# Altium schematic sheet Servo Level Shifter.SchDoc
size A; SheetNumber: 4; SheetTotal: 4
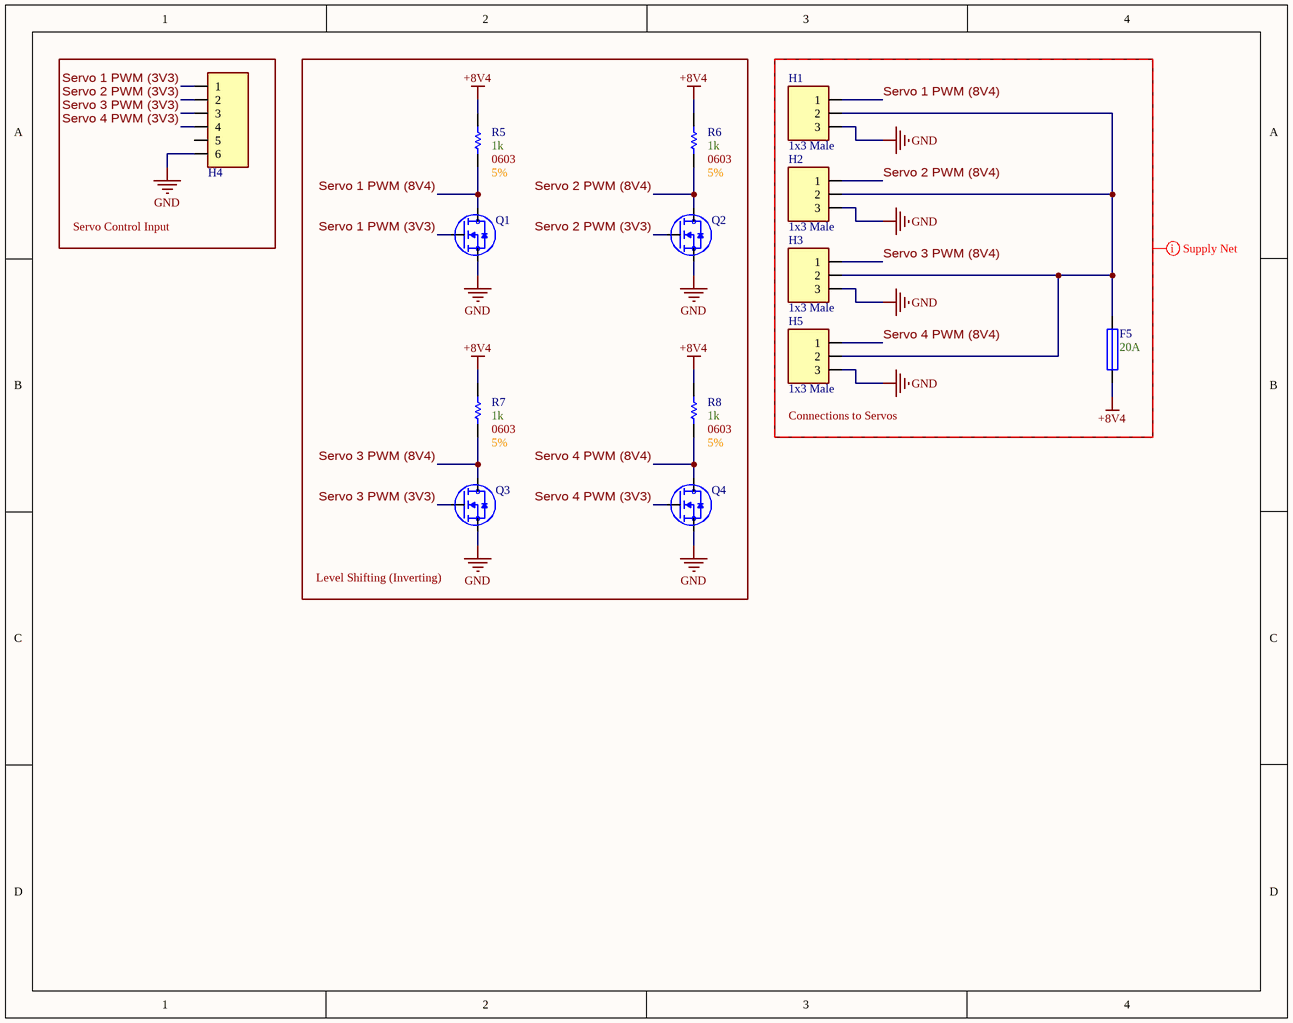
[diagram p0: Servo Level Shifter.SchDoc]

## Parts
F5  Capacity: 20A  [[Fuse] Thru-Hole Blade]  (hidden comment: Thru-Hole)
H1  1x3 Male  [[Header] Shrouded 1x3 Male]
H2  1x3 Male  [[Header] Shrouded 1x3 Male]
H3  1x3 Male  [[Header] Shrouded 1x3 Male]
H4  [Header] Shrouded 1x6 Male  [[Header] Shrouded 1x6 Male]  (value not drawn)
H5  1x3 Male  [[Header] Shrouded 1x3 Male]
Q1  DMG1012UW-7  [[FET] N-Channel Mosfet]  (value not drawn)
Q2  DMG1012UW-7  [[FET] N-Channel Mosfet]  (value not drawn)
Q3  DMG1012UW-7  [[FET] N-Channel Mosfet]  (value not drawn)
Q4  DMG1012UW-7  [[FET] N-Channel Mosfet]  (value not drawn)
R5  Tolerance: 5%  Resistance: 1k  Size Package: 0603  [[Res] SMD 0603]  (hidden comment: [Res] SMD Resistor)
R6  Tolerance: 5%  Resistance: 1k  Size Package: 0603  [[Res] SMD 0603]  (hidden comment: [Res] SMD Resistor)
R7  Tolerance: 5%  Resistance: 1k  Size Package: 0603  [[Res] SMD 0603]  (hidden comment: [Res] SMD Resistor)
R8  Tolerance: 5%  Resistance: 1k  Size Package: 0603  [[Res] SMD 0603]  (hidden comment: [Res] SMD Resistor)

## Blocks framed on the sheet
Servo Control Input: H4
Level Shifting (Inverting): Q1-Q4 R5-R8
Connections to Servos: F5 H1-H3 H5

## Nets
+8V4: F5.1 R5.2 R6.2 R7.2 R8.2
GND: H1.3 H2.3 H3.3 H4.6 H5.3 Q1.2(Source) Q2.2(Source) Q3.2(Source) Q4.2(Source)
Servo 1 PWM (3V3): H4.1 Q1.1(Gate)
Servo 1 PWM (8V4): H1.1 Q1.3(Drain) R5.1
Servo 2 PWM (3V3): H4.2 Q2.1(Gate)
Servo 2 PWM (8V4): H2.1 Q2.3(Drain) R6.1
Servo 3 PWM (3V3): H4.3 Q3.1(Gate)
Servo 3 PWM (8V4): H3.1 Q3.3(Drain) R7.1
Servo 4 PWM (3V3): H4.4 Q4.1(Gate)
Servo 4 PWM (8V4): H5.1 Q4.3(Drain) R8.1
NetF5_2: F5.2 H1.2 H2.2 H3.2 H5.2

Not connected (* = marked no-connect by the designer): H4 5

## Layout directives
net class Supply_Nets: +8V4, GND, Servo 1 PWM (8V4), Servo 2 PWM (8V4), Servo 3 PWM (8V4), Servo 4 PWM (8V4)

## Library data of the parts
F5 = [Fuse] Thru-Hole Blade: Mouser Part #: *; Supplier 1: DigiKey; Supplier Part Number 1: WK6265-ND
H1-H3 H5 = [Header] Shrouded 1x3 Male: 070543-0037 / Mates with 005057-9403; Supplier 1: DigiKey; Supplier 2: DigiKey; Supplier Part Number 1: WM4825-ND; Supplier Part Number 2: WM2901-ND
H4 = [Header] Shrouded 1x6 Male: 0705430005 / Mates with 0050579406; Supplier 1: DigiKey; Supplier 2: DigiKey; Supplier Part Number 1: WM4804-ND; Supplier Part Number 2: WM2904-ND
Q1-Q4 = [FET] N-Channel MOSFET: Supplier 1: DigiKey; Supplier Part Number 1: DMG1012UW-7DICT-ND
R5-R8 = [Res] SMD Resistor: Generic; Supplier 1: DigiKey; Supplier Part Number 1: RMCF0603FT1K00DKR-ND